# Altium schematic sheet TarjetaMicrofono.SchDoc
size A4
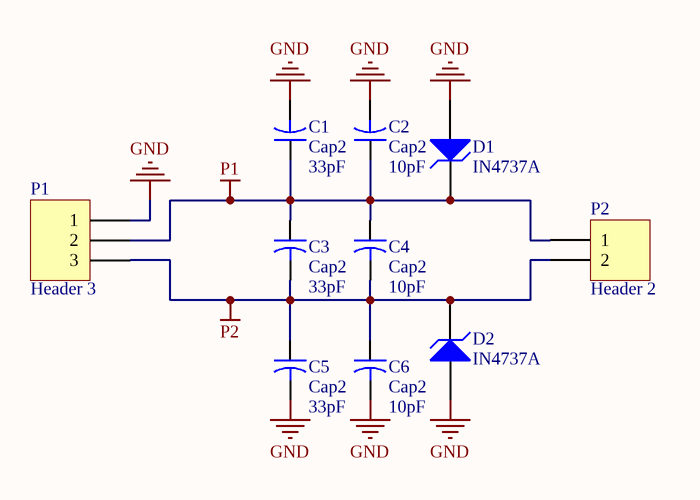
[diagram p0: TarjetaMicrofono.SchDoc]

## Parts
C1  Cap2  value 33pF  [CAPR5-4X5]
C2  Cap2  value 10pF  [CAPR5-4X5]
C3  Cap2  value 33pF  [CAPR5-4X5]
C4  Cap2  value 10pF  [CAPR5-4X5]
C5  Cap2  value 33pF  [CAPR5-4X5]
C6  Cap2  value 10pF  [CAPR5-4X5]
D1  IN4737A  [DIODE-0.7]
D2  IN4737A  [DIODE-0.7]
P1  Header 3  [HDR1X3]
P2  Header 2  [HDR1X2]

## Nets
GND: C1.2 C2.2 C5.2 C6.2 D1.1(A) D2.1(A) P1.1
P1: C1.1 C2.1 C3.1 C4.1 D1.2(K) P1.2 P2.1
P2: C3.2 C4.2 C5.1 C6.1 D2.2(K) P1.3 P2.2

## Library data of the parts
C1-C6 = Cap2: Capacitor; Published: 23-Sep-2002; PackageReference: CAPR5-4X5; Publisher: Altium Limited; PackageDescription: Capacitor; 2 Leads
D1 D2 = D Zener: Zener Diode; Published: 8-Jun-2000; LatestRevisionDate: 17-Jul-2002; LatestRevisionNote: Re-released for DXP Platform.; PackageReference: DIODE-0.7; Publisher: Altium Limited; PackageDescription: Diode, Thru-Hole; 2 Leads; 0.7 in Pin Spacing
P1 = Header 3: Header, 3-Pin; LatestRevisionDate: 17-Jul-2002; LatestRevisionNote: Re-released for DXP Platform.; Publisher: Altium Limited
P2 = Header 2: Header, 2-Pin; LatestRevisionDate: 17-Jul-2002; LatestRevisionNote: Re-released for DXP Platform.; Publisher: Altium Limited